# Altium schematic sheet UART.SchDoc
size A4
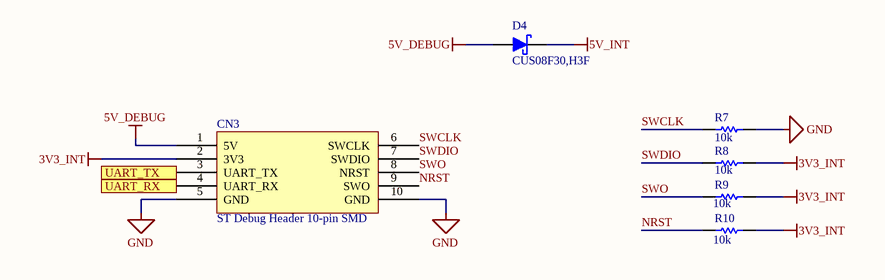
[diagram p0: UART.SchDoc]

## Parts
CN3  ST Debug Header 10-pin SMD  [ST Debug Header 10-pin SMD-Footprint-1]
D4  CUS08F30,H3F  [SC-76]
R7  value 10k  [RESC1608N(0603")]  (hidden comment: 10kR, 1%, 1/10W, 0603 SMD)
R8  value 10k  [RESC1608N(0603")]  (hidden comment: 10kR, 1%, 1/10W, 0603 SMD)
R9  value 10k  [RESC1608N(0603")]  (hidden comment: 10kR, 1%, 1/10W, 0603 SMD)
R10  value 10k  [RESC1608N(0603")]  (hidden comment: 10kR, 1%, 1/10W, 0603 SMD)

## Ports
UART_RX, UART_TX

## Nets
3V3_INT: CN3.2(3V3) R8.2 R9.2 R10.2
5V_DEBUG: CN3.1(5V) D4.A(Anode)
5V_INT: D4.K(Cathode)
GND: CN3.5(GND) CN3.10(GND) R7.2
NRST: CN3.9(SWO) R10.1
SWCLK: CN3.6(SWCLK) R7.1
SWDIO: CN3.7(SWDIO) R8.1
SWO: CN3.8(NRST) R9.1
UART_RX: CN3.4(UART_RX) ; port UART_RX
UART_TX: CN3.3(UART_TX) ; port UART_TX

## Library data of the parts
CN3 = CMP-00013-1: CONN HEADER SMD 10POS 2.54MM; Row Spacing: 0.1inch; Connector Type: Male Pin; Number of Positions: 10; Mount: Surface Mount; Package Quantity: 1; Packaging: Rail/Tube; Termination: Solder; Contact Plating: Gold; Number of Rows: 2; Lead Free: Lead Free; Pitch: 0.1inch; Color: Black
D4 = CMP-057-0000-2: Diode Schottky 30V 800mA Surface Mount USC; Peak Non-Repetitive Surge Current: 5A; Element Configuration: Single; Peak Reverse Current: 50uA; Packaging: Tape and Reel; Mount: Surface Mount; Average Rectified Current: 800mA; Case/Package: SOD; Max Reverse Voltage (DC): 30V; Min Operating Temperature: -55°C; Contact Plating: Tin,Silver; Max Repetitive Reverse Voltage (Vrrm): 30V; Number of Pins: 2; Max Operating Temperature: 125°C
R7-R10 = CMP-047-0013-1: Owned By: AUVic; Made By: Ashwin Sira; Design Item ID: 10kR, 1%, 1/10W, 0603 SMD; Pin Count: 2; Component Type: Standard; Created On: 14-05-31; Last Edited: 14-05-31; Source: AUVic_Schematic_Library_Resistors.SchLib